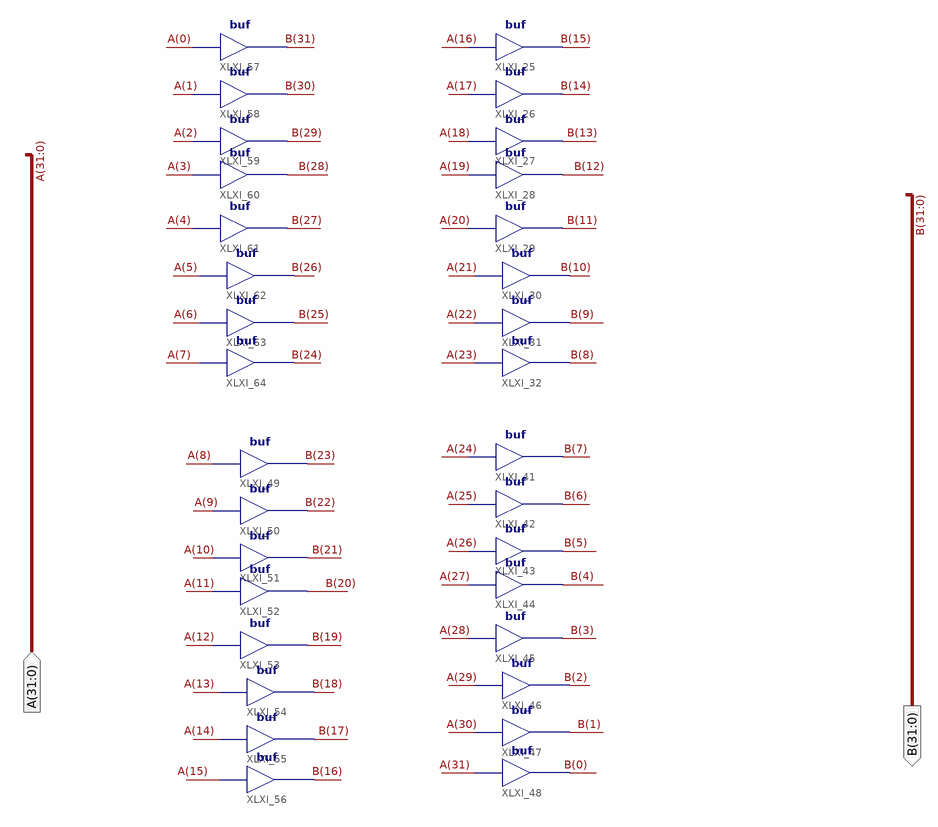
[diagram p0: schematic sheet 1]
// Xilinx ISE schematic mirror.sch (artix7) as structural Verilog: 32 symbols, 2 ports
module mirror (
  input  [31:0] A,
  output [31:0] B
);

  buf XLXI_25 (B[15], A[16]);
  buf XLXI_26 (B[14], A[17]);
  buf XLXI_27 (B[13], A[18]);
  buf XLXI_28 (B[12], A[19]);
  buf XLXI_29 (B[11], A[20]);
  buf XLXI_30 (B[10], A[21]);
  buf XLXI_31 (B[9], A[22]);
  buf XLXI_32 (B[8], A[23]);
  buf XLXI_41 (B[7], A[24]);
  buf XLXI_42 (B[6], A[25]);
  buf XLXI_43 (B[5], A[26]);
  buf XLXI_44 (B[4], A[27]);
  buf XLXI_45 (B[3], A[28]);
  buf XLXI_46 (B[2], A[29]);
  buf XLXI_47 (B[1], A[30]);
  buf XLXI_48 (B[0], A[31]);
  buf XLXI_49 (B[23], A[8]);
  buf XLXI_50 (B[22], A[9]);
  buf XLXI_51 (B[21], A[10]);
  buf XLXI_52 (B[20], A[11]);
  buf XLXI_53 (B[19], A[12]);
  buf XLXI_54 (B[18], A[13]);
  buf XLXI_55 (B[17], A[14]);
  buf XLXI_56 (B[16], A[15]);
  buf XLXI_57 (B[31], A[0]);
  buf XLXI_58 (B[30], A[1]);
  buf XLXI_59 (B[29], A[2]);
  buf XLXI_60 (B[28], A[3]);
  buf XLXI_61 (B[27], A[4]);
  buf XLXI_62 (B[26], A[5]);
  buf XLXI_63 (B[25], A[6]);
  buf XLXI_64 (B[24], A[7]);
endmodule
